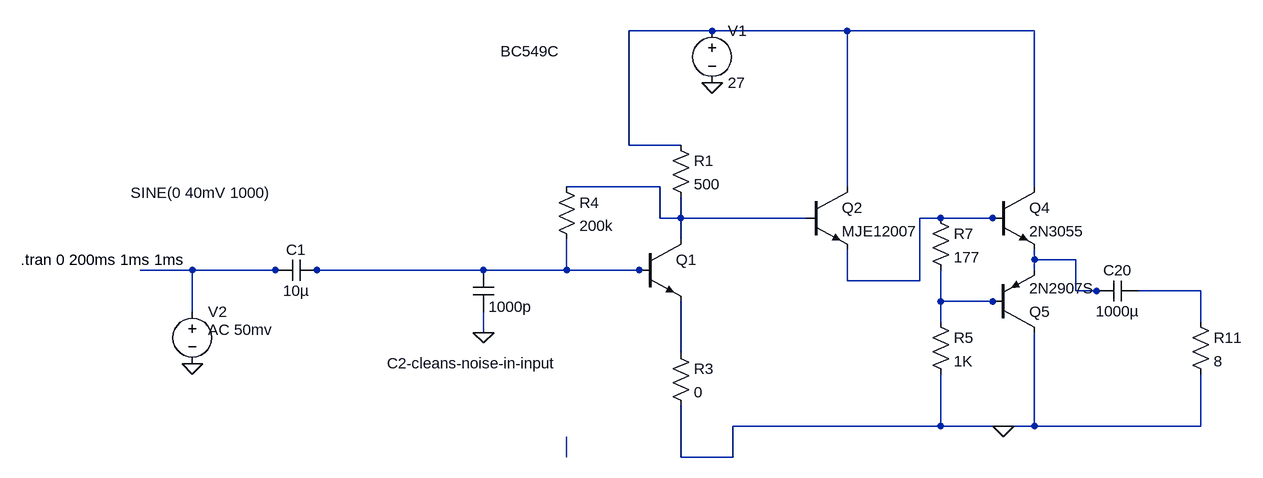
[diagram p0: schematic Base bias test.asc]
Base bias test.asc, the LTspice schematic file:
Version 4
SHEET 1 1788 680
WIRE 272 -256 144 -256
WIRE 480 -256 272 -256
WIRE 768 -256 480 -256
WIRE 144 -80 144 -256
WIRE 224 -80 144 -80
WIRE 192 -16 48 -16
WIRE 480 -16 480 -256
WIRE 768 -16 768 -256
WIRE 192 32 192 -16
WIRE 224 32 224 0
WIRE 224 32 192 32
WIRE 416 32 224 32
WIRE 624 32 592 32
WIRE 704 32 624 32
WIRE 720 32 704 32
WIRE 224 64 224 32
WIRE 768 96 768 80
WIRE 832 96 768 96
WIRE -528 112 -608 112
WIRE -400 112 -528 112
WIRE -384 112 -400 112
WIRE -336 112 -352 112
WIRE -80 112 -336 112
WIRE 48 112 48 64
WIRE 48 112 -80 112
WIRE 160 112 48 112
WIRE 176 112 160 112
WIRE 768 112 768 96
WIRE 480 128 480 80
WIRE 592 128 592 32
WIRE 592 128 480 128
WIRE 832 144 832 96
WIRE 864 144 832 144
WIRE 880 144 864 144
WIRE 1024 144 928 144
WIRE 624 160 624 112
WIRE 704 160 624 160
WIRE 720 160 704 160
WIRE -528 176 -528 112
WIRE 624 192 624 160
WIRE 1024 192 1024 144
WIRE -80 208 -80 176
WIRE 224 240 224 160
WIRE 624 352 624 272
WIRE 624 352 304 352
WIRE 720 352 624 352
WIRE 768 352 768 208
WIRE 768 352 720 352
WIRE 1024 352 1024 272
WIRE 1024 352 768 352
WIRE 48 400 48 368
WIRE 224 400 224 320
WIRE 304 400 304 352
WIRE 304 400 224 400
FLAG 272 -176 0
FLAG -528 256 0
FLAG 720 352 0
FLAG -80 208 0
SYMBOL npn 160 64 R0
WINDOW 3 -214 -289 Left 2
SYMATTR Value BC549C
SYMATTR InstName Q1
SYMBOL res 208 -96 R0
SYMATTR InstName R1
SYMATTR Value 500
SYMBOL voltage 272 -272 R0
WINDOW 123 0 0 Left 2
WINDOW 39 0 0 Left 2
SYMATTR InstName V1
SYMATTR Value 27
SYMBOL res 32 -32 R0
SYMATTR InstName R4
SYMATTR Value 200k
SYMBOL cap -336 96 R90
WINDOW 0 0 32 VBottom 2
WINDOW 3 32 32 VTop 2
SYMATTR InstName C1
SYMATTR Value 10µ
SYMBOL voltage -528 160 R0
WINDOW 123 24 44 Left 2
WINDOW 39 24 72 Left 2
WINDOW 3 -95 -167 Left 2
SYMATTR Value2 AC 50mv
SYMATTR Value SINE(0 40mV 1000)
SYMATTR InstName V2
SYMBOL npn2 704 -16 R0
SYMATTR InstName Q4
SYMATTR Value 2N3055
SYMBOL res 1008 176 R0
SYMATTR InstName R11
SYMATTR Value 8
SYMBOL pnp 704 208 M180
SYMATTR InstName Q5
SYMATTR Value 2N2907S
SYMBOL cap 928 128 R90
WINDOW 0 0 32 VBottom 2
WINDOW 3 32 32 VTop 2
SYMATTR InstName C20
SYMATTR Value 1000µ
SYMBOL res 608 176 R0
SYMATTR InstName R5
SYMATTR Value 1K
SYMBOL res 608 16 R0
SYMATTR InstName R7
SYMATTR Value 177
SYMBOL npn 416 -16 R0
SYMATTR InstName Q2
SYMATTR Value MJE12007
SYMBOL cap -96 112 R0
WINDOW 0 -132 143 Left 2
SYMATTR InstName C2-cleans-noise-in-input
SYMATTR Value 1000p
SYMBOL res 208 224 R0
SYMATTR InstName R3
SYMATTR Value 0
TEXT -792 96 Left 2 !.tran 0 200ms 1ms 1ms

The netlist it stands for:
* Base bias test.asc
Q1 N002 N006 N009 0 BC549C
R1 N001 N002 500
V1 N001 0 27
R4 N002 N006 200k
C1 N006 N005 10µ
V2 N005 0 SINE(0 40mV 1000) AC 50mv
Q4 N001 N003 N004 0 2N3055
R11 N007 0 8
Q5 0 N008 N004 0 2N2907S
C20 N007 N004 1000µ
R5 N008 0 1K
R7 N003 N008 177
Q2 N001 N002 N003 0 MJE12007
C2-cleans-noise-in-input N006 0 1000p
R3 N009 0 0
.model NPN NPN
.model PNP PNP
.lib standard.bjt
.tran 0 200ms 1ms 1ms
.backanno
.end